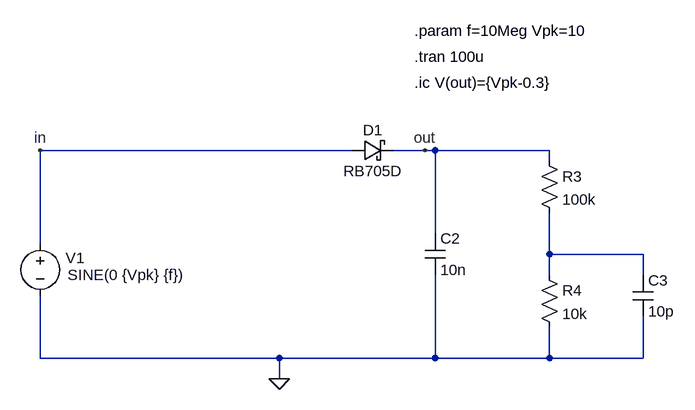
[diagram p0: schematic peak_detector_diode_comp_ver3.asc]
peak_detector_diode_comp_ver3.asc, the LTspice schematic file:
Version 4
SHEET 1 1120 680
WIRE 272 48 -208 48
WIRE 384 48 336 48
WIRE 400 48 384 48
WIRE 576 48 400 48
WIRE 576 64 576 48
WIRE 400 176 400 48
WIRE -208 192 -208 48
WIRE 576 208 576 144
WIRE 720 208 576 208
WIRE 576 240 576 208
WIRE 720 240 720 208
WIRE -208 368 -208 272
WIRE 160 368 -208 368
WIRE 400 368 400 240
WIRE 400 368 160 368
WIRE 576 368 576 320
WIRE 576 368 400 368
WIRE 720 368 720 304
WIRE 720 368 576 368
WIRE 160 400 160 368
FLAG 384 48 out
FLAG -208 48 in
FLAG 160 400 0
SYMBOL schottky 272 64 R270
WINDOW 0 32 32 VTop 2
WINDOW 3 0 32 VBottom 2
SYMATTR InstName D1
SYMATTR Value RB705D
SYMATTR Description Diode
SYMATTR Type diode
SYMBOL voltage -208 176 R0
WINDOW 3 42 64 Left 2
WINDOW 123 24 124 Left 2
WINDOW 39 0 0 Left 0
WINDOW 0 39 38 Left 2
SYMATTR Value SINE(0 {Vpk} {f})
SYMATTR InstName V1
SYMBOL cap 384 176 R0
SYMATTR InstName C2
SYMATTR Value 10n
SYMBOL res 560 48 R0
SYMATTR InstName R3
SYMATTR Value 100k
SYMBOL res 560 224 R0
SYMATTR InstName R4
SYMATTR Value 10k
SYMBOL cap 704 240 R0
SYMATTR InstName C3
SYMATTR Value 10p
TEXT 368 -136 Left 2 !.param f=10Meg Vpk=10
TEXT 368 -96 Left 2 !.tran 100u
TEXT 368 -56 Left 2 !.ic V(out)={Vpk-0.3}

The netlist it stands for:
* peak_detector_diode_comp_ver3.asc
D1 in out RB705D
V1 in 0 SINE(0 {Vpk} {f})
C2 out 0 10n
R3 out N001 100k
R4 N001 0 10k
C3 N001 0 10p
.model D D
.lib standard.dio
.param f=10Meg Vpk=10
.tran 100u
.ic V(out)={Vpk-0.3}
.backanno
.end